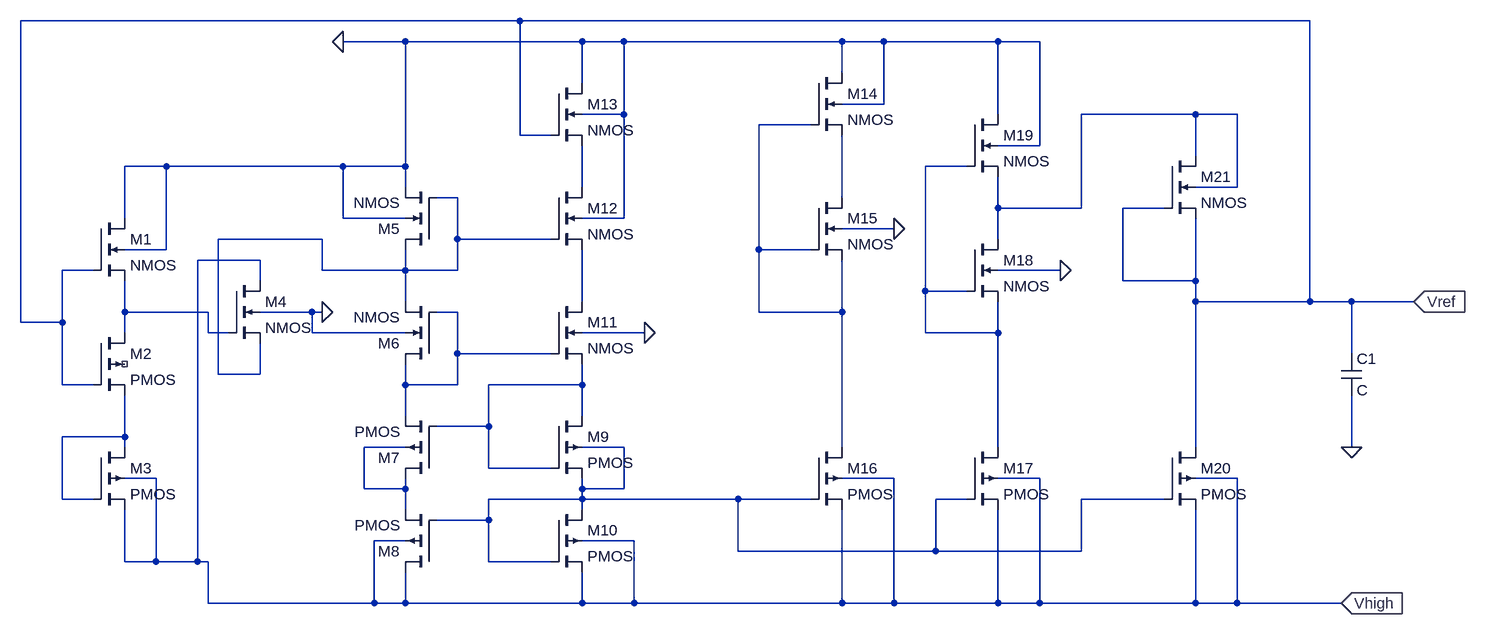
[diagram p0: schematic Vreference.asc]
Vreference.asc, the LTspice schematic file:
Version 4
SHEET 1 2252 680
WIRE 768 -368 0 -368
WIRE 1984 -368 768 -368
WIRE 592 -336 496 -336
WIRE 864 -336 592 -336
WIRE 928 -336 864 -336
WIRE 1264 -336 928 -336
WIRE 1328 -336 1264 -336
WIRE 1504 -336 1328 -336
WIRE 1568 -336 1504 -336
WIRE 1264 -288 1264 -336
WIRE 864 -272 864 -336
WIRE 1328 -240 1328 -336
WIRE 1328 -240 1264 -240
WIRE 928 -224 928 -336
WIRE 928 -224 864 -224
WIRE 1504 -224 1504 -336
WIRE 1808 -224 1632 -224
WIRE 1872 -224 1808 -224
WIRE 1216 -208 1136 -208
WIRE 768 -192 768 -368
WIRE 816 -192 768 -192
WIRE 1568 -176 1568 -336
WIRE 1568 -176 1504 -176
WIRE 1808 -160 1808 -224
WIRE 224 -144 160 -144
WIRE 496 -144 224 -144
WIRE 592 -144 592 -336
WIRE 592 -144 496 -144
WIRE 1456 -144 1392 -144
WIRE 592 -112 592 -144
WIRE 864 -112 864 -176
WIRE 1872 -112 1872 -224
WIRE 1872 -112 1808 -112
WIRE 672 -96 640 -96
WIRE 1264 -96 1264 -192
WIRE 1504 -80 1504 -128
WIRE 1632 -80 1632 -224
WIRE 1632 -80 1504 -80
WIRE 1760 -80 1696 -80
WIRE 160 -64 160 -144
WIRE 496 -64 496 -144
WIRE 592 -64 496 -64
WIRE 928 -64 928 -224
WIRE 928 -64 864 -64
WIRE 1344 -48 1264 -48
WIRE 464 -32 304 -32
WIRE 672 -32 672 -96
WIRE 816 -32 672 -32
WIRE 1504 -32 1504 -80
WIRE 224 -16 224 -144
WIRE 224 -16 160 -16
WIRE 1136 -16 1136 -208
WIRE 1216 -16 1136 -16
WIRE 368 0 272 0
WIRE 112 16 64 16
WIRE 464 16 464 -32
WIRE 592 16 592 -16
WIRE 592 16 464 16
WIRE 672 16 672 -32
WIRE 672 16 592 16
WIRE 1600 16 1504 16
WIRE 368 32 368 0
WIRE 1696 32 1696 -80
WIRE 1808 32 1808 -64
WIRE 1808 32 1696 32
WIRE 1392 48 1392 -144
WIRE 1456 48 1392 48
WIRE 592 64 592 16
WIRE 864 64 864 -16
WIRE 1808 64 1808 32
WIRE 1984 64 1984 -368
WIRE 1984 64 1808 64
WIRE 2048 64 1984 64
WIRE 2144 64 2048 64
WIRE 160 80 160 32
WIRE 288 80 160 80
WIRE 448 80 368 80
WIRE 464 80 448 80
WIRE 672 80 640 80
WIRE 1136 80 1136 -16
WIRE 1264 80 1264 0
WIRE 1264 80 1136 80
WIRE 0 96 0 -368
WIRE 64 96 64 16
WIRE 64 96 0 96
WIRE 160 112 160 80
WIRE 288 112 288 80
WIRE 320 112 288 112
WIRE 448 112 448 80
WIRE 592 112 448 112
WIRE 960 112 864 112
WIRE 1392 112 1392 48
WIRE 1504 112 1504 64
WIRE 1504 112 1392 112
WIRE 672 144 672 80
WIRE 816 144 672 144
WIRE 2048 144 2048 64
WIRE 304 176 304 -32
WIRE 368 176 368 128
WIRE 368 176 304 176
WIRE 64 192 64 96
WIRE 112 192 64 192
WIRE 592 192 592 160
WIRE 672 192 672 144
WIRE 672 192 592 192
WIRE 864 192 864 160
WIRE 864 192 720 192
WIRE 592 240 592 192
WIRE 864 240 864 192
WIRE 720 256 720 192
WIRE 720 256 640 256
WIRE 160 272 160 208
WIRE 160 272 64 272
WIRE 160 288 160 272
WIRE 592 288 528 288
WIRE 928 288 864 288
WIRE 1264 288 1264 80
WIRE 1504 288 1504 112
WIRE 1808 288 1808 64
WIRE 2048 288 2048 208
WIRE 720 320 720 256
WIRE 816 320 720 320
WIRE 208 336 160 336
WIRE 1344 336 1264 336
WIRE 1568 336 1504 336
WIRE 1872 336 1808 336
WIRE 528 352 528 288
WIRE 592 352 592 336
WIRE 592 352 528 352
WIRE 864 352 864 336
WIRE 928 352 928 288
WIRE 928 352 864 352
WIRE 64 368 64 272
WIRE 112 368 64 368
WIRE 864 368 864 352
WIRE 864 368 720 368
WIRE 1104 368 864 368
WIRE 1216 368 1104 368
WIRE 1456 368 1408 368
WIRE 1760 368 1632 368
WIRE 592 384 592 352
WIRE 864 384 864 368
WIRE 720 400 720 368
WIRE 720 400 640 400
WIRE 592 432 544 432
WIRE 944 432 864 432
WIRE 1104 448 1104 368
WIRE 1408 448 1408 368
WIRE 1408 448 1104 448
WIRE 1632 448 1632 368
WIRE 1632 448 1408 448
WIRE 160 464 160 384
WIRE 208 464 208 336
WIRE 208 464 160 464
WIRE 272 464 272 0
WIRE 272 464 208 464
WIRE 288 464 272 464
WIRE 720 464 720 400
WIRE 816 464 720 464
WIRE 288 528 288 464
WIRE 544 528 544 432
WIRE 544 528 288 528
WIRE 592 528 592 480
WIRE 592 528 544 528
WIRE 864 528 864 480
WIRE 864 528 592 528
WIRE 944 528 944 432
WIRE 944 528 864 528
WIRE 1264 528 1264 384
WIRE 1264 528 944 528
WIRE 1344 528 1344 336
WIRE 1344 528 1264 528
WIRE 1504 528 1504 384
WIRE 1504 528 1344 528
WIRE 1568 528 1568 336
WIRE 1568 528 1504 528
WIRE 1808 528 1808 384
WIRE 1808 528 1568 528
WIRE 1872 528 1872 336
WIRE 1872 528 1808 528
WIRE 2032 528 1872 528
FLAG 464 80 0
FLAG 496 -336 0
FLAG 960 112 0
FLAG 1344 -48 0
FLAG 1600 16 0
FLAG 2048 288 0
FLAG 2144 64 Vref
IOPIN 2144 64 In
FLAG 2032 528 Vhigh
IOPIN 2032 528 In
SYMBOL pmos4 112 112 R0
SYMATTR InstName M2
SYMBOL nmos4 112 -64 R0
SYMATTR InstName M1
SYMBOL pmos4 112 288 R0
SYMATTR InstName M3
SYMBOL nmos4 320 32 R0
SYMATTR InstName M4
SYMBOL nmos4 640 -16 R180
SYMATTR InstName M5
SYMBOL nmos4 640 160 R180
SYMATTR InstName M6
SYMBOL pmos4 640 336 R180
SYMATTR InstName M7
SYMBOL pmos4 640 480 R180
SYMATTR InstName M8
SYMBOL pmos4 816 240 R0
SYMATTR InstName M9
SYMBOL pmos4 816 384 R0
SYMATTR InstName M10
SYMBOL nmos4 816 64 R0
SYMATTR InstName M11
SYMBOL nmos4 816 -112 R0
SYMATTR InstName M12
SYMBOL nmos4 816 -272 R0
SYMATTR InstName M13
SYMBOL nmos4 1216 -288 R0
SYMATTR InstName M14
SYMBOL nmos4 1216 -96 R0
SYMATTR InstName M15
SYMBOL pmos4 1216 288 R0
SYMATTR InstName M16
SYMBOL pmos4 1456 288 R0
SYMATTR InstName M17
SYMBOL nmos4 1456 -32 R0
SYMATTR InstName M18
SYMBOL nmos4 1456 -224 R0
SYMATTR InstName M19
SYMBOL pmos4 1760 288 R0
SYMATTR InstName M20
SYMBOL nmos4 1760 -160 R0
SYMATTR InstName M21
SYMBOL cap 2032 144 R0
SYMATTR InstName C1

The netlist it stands for:
* Vreference.asc
M2 N008 Vref N011 NC_01 PMOS
M1 0 Vref N008 0 NMOS
M3 N011 N011 Vhigh Vhigh PMOS
M4 Vhigh N008 N005 0 NMOS
M5 N005 N005 0 0 NMOS
M6 N009 N009 N005 0 NMOS
M7 N012 N010 N009 N012 PMOS
M8 Vhigh N013 N012 Vhigh PMOS
M9 N010 N010 N013 N013 PMOS
M10 N013 N013 Vhigh Vhigh PMOS
M11 N007 N009 N010 0 NMOS
M12 N004 N005 N007 0 NMOS
M13 0 Vref N004 0 NMOS
M14 0 N002 N006 0 NMOS
M15 N006 N002 N002 0 NMOS
M16 N002 N013 Vhigh Vhigh PMOS
M17 N003 N013 Vhigh Vhigh PMOS
M18 N001 N003 N003 0 NMOS
M19 0 N003 N001 0 NMOS
M20 Vref N013 Vhigh Vhigh PMOS
M21 N001 Vref Vref N001 NMOS
C1 Vref 0 C
.model NMOS NMOS
.model PMOS PMOS
.lib standard.mos
.backanno
.end